# EasyEDA Pro project 交换机工具.epro, board PCB104
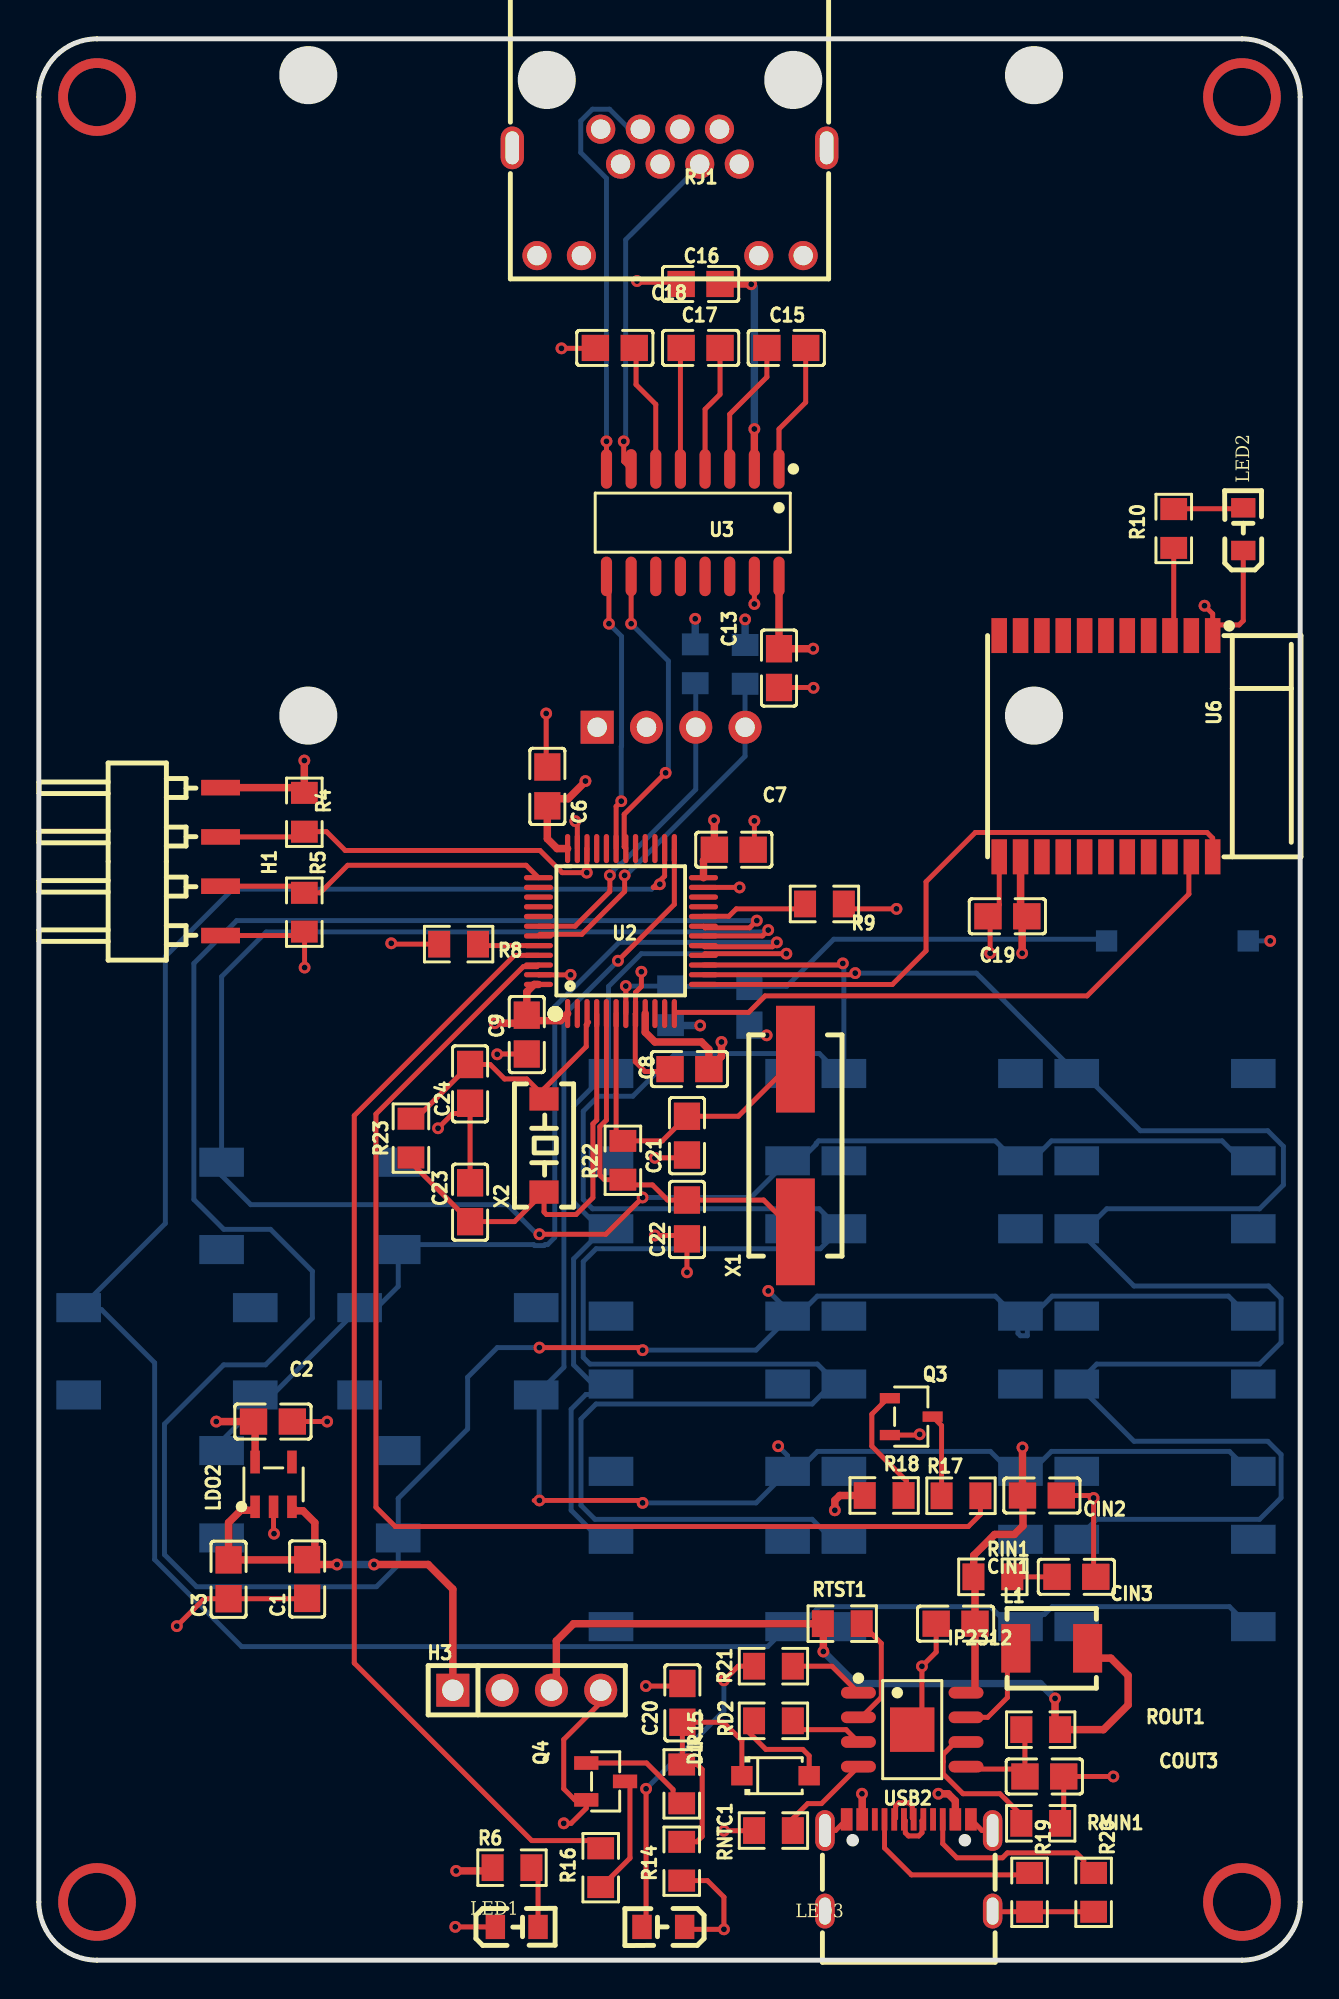
[diagram p4: board, top side]
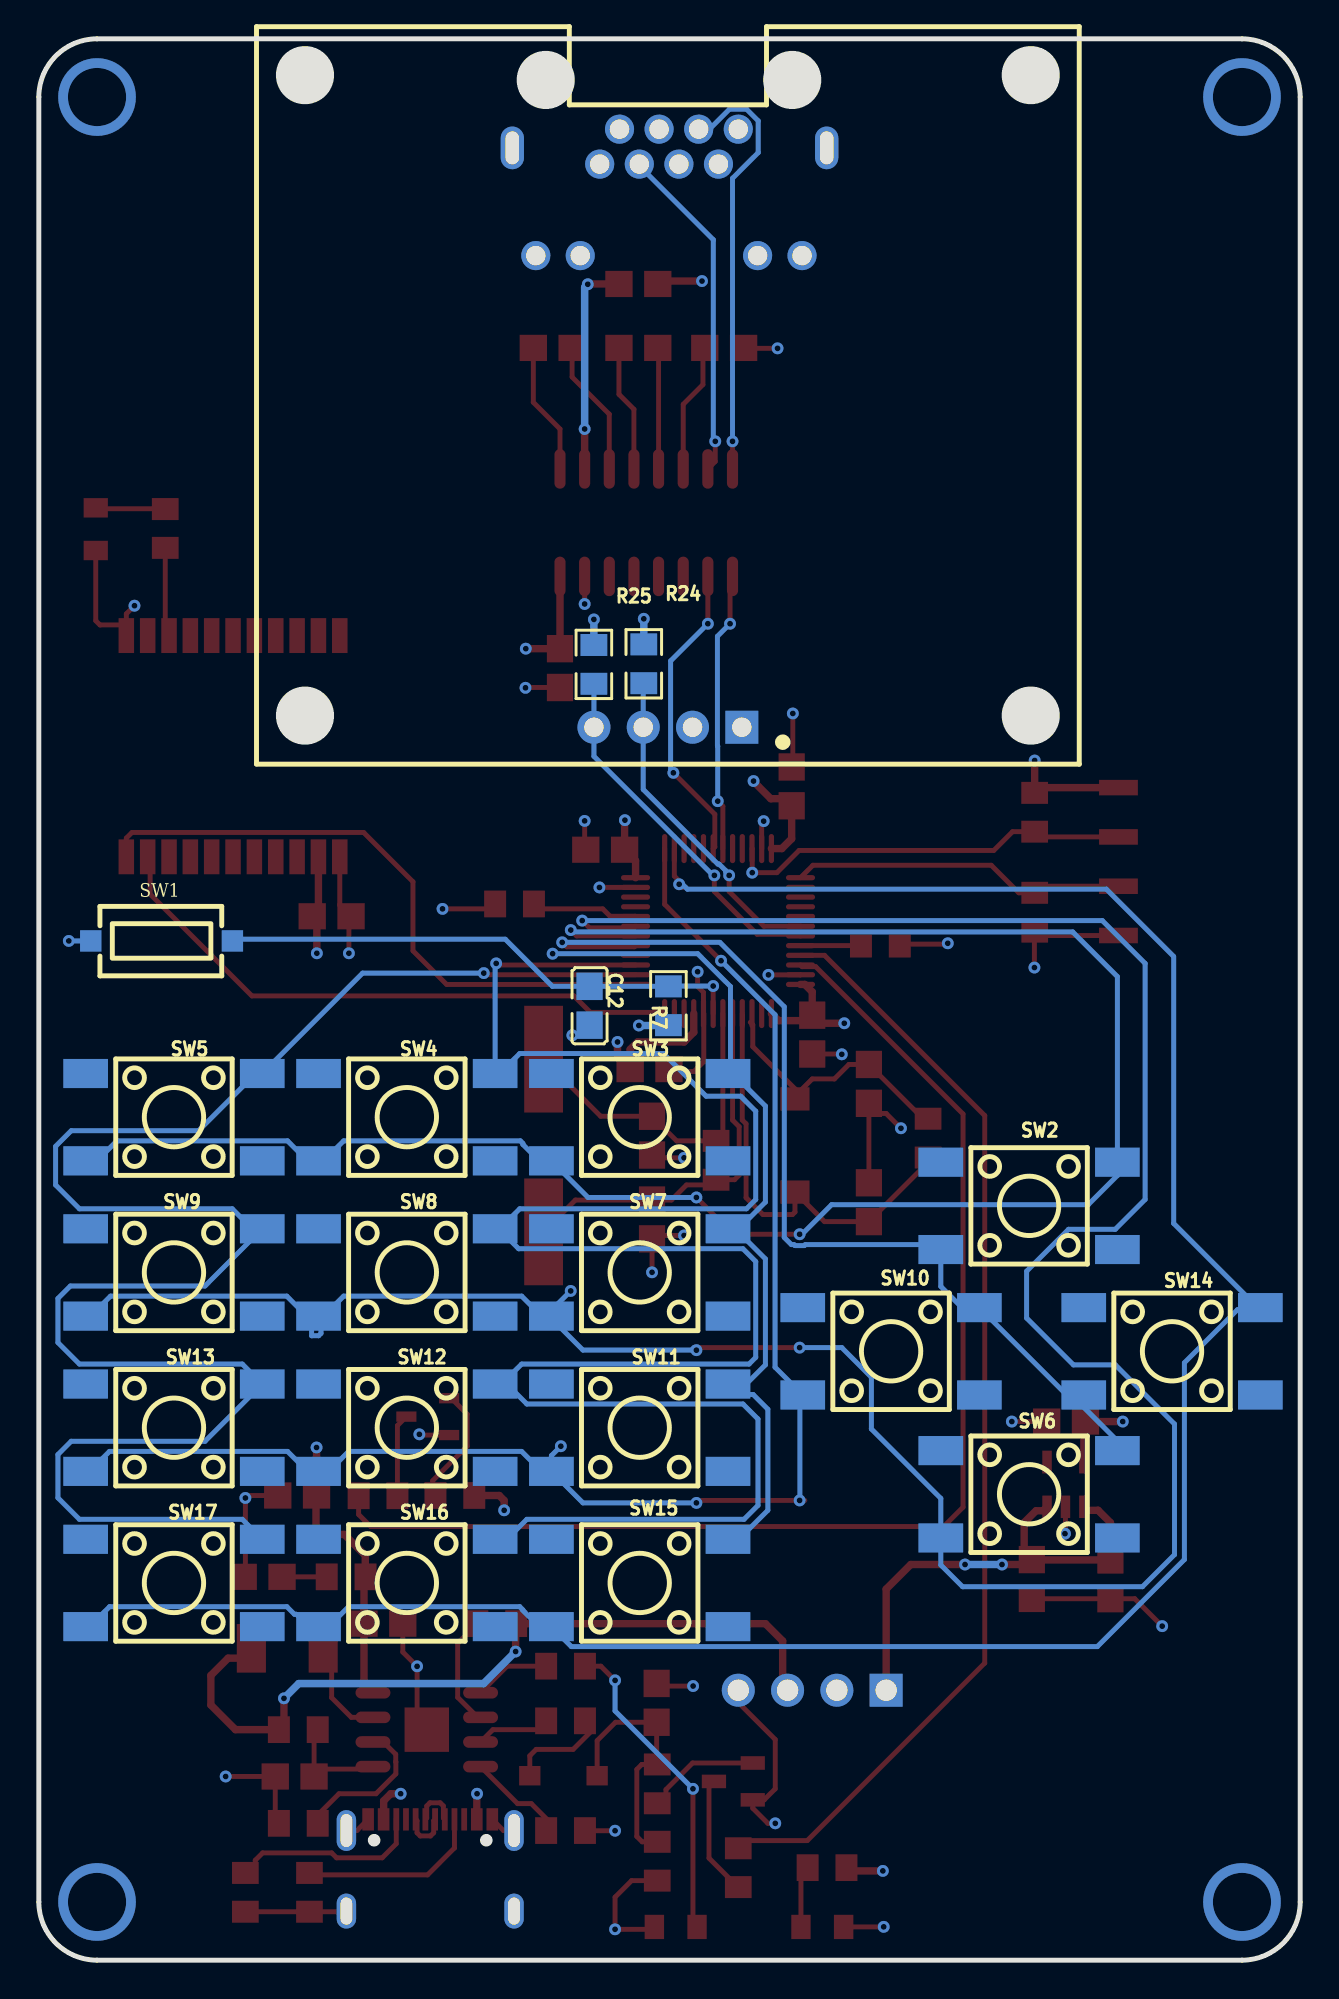
[diagram p5: board, bottom side, seen from below]

Outline 65 x 99 mm; copper layers: Top Layer, GND, PWR, Bottom Layer. Coordinates in mm from the lower left corner of the outline.
Outline path: 0,96 0,3 arc(0.88,0.88) 3,0 62,0 arc(64.12,0.88) 65,3 65,96 arc(64.12,98.12) 62,99 3,99 arc(0.88,98.12) 0,96
Stack: Top Layer 0.035mm 外层铜厚1oz / Dielectric1 0.2104mm 7628 RC49% 8.6mil / GND 0.0152mm 内层铜厚 / Dielectric2 1.065mm 1.1mm H/HOZ Copper / PWR 0.0152mm 内层铜厚 / Dielectric3 0.2104mm 7628 RC49% 8.6mil / Bottom Layer 0.035mm 外层铜厚1oz

## Design rules (mm)
template: 自定义配置
spacing copperThickness1oz (default): track to track 0.102, other pairs 0.152 to 0.3
spacing copperThickness2oz: track to track 0.203, other pairs 0.152 to 0.3
track width copperThickness1oz (default): min 0.127, default 0.254, max 2.54
track width copperThickness2oz: min 0.381, default 0.381, max 2.54
differential pair differentialPair (default): width min 0.127, default 0.254, max 2.54; gap min 0.152, default 0.152
via viaSize (default): diameter min 0.5, default 0.61, max 10; hole min 0.3, default 0.305, max 6.299
net 3V3 uses copperThickness2oz
net VBUS uses copperThickness2oz
net BAT+ uses copperThickness2oz

## Placement (name value [footprint] x y rotation side)
C1  10uF  [C0805]  13.83 19.64 90 top
C2  1uF  [C0805]  12.07 27.75 180 top
C3  100nF  [C0805]  9.78 19.62 90 top
C6  100nF  [C0805]  26.21 60.48 270 top
C7  100nF  [C0805]  35.81 57.22 180 top
C8  100nF  [C0805]  33.53 45.91 0 top
C9  100nF  [C0805]  25.15 47.69 90 top
C12  100nF  [C0805]  36.62 49.18 90 bottom
C13  0.1uF  [C0805]  38.14 66.58 270 top
C15  0.1uF  [C0805]  38.52 83.07 0 top
C16  0.1uF  [C0805]  34.1 86.37 0 top
C17  0.1uF  [C0805]  34.1 83.07 0 top
C18  0.1uF  [C0805]  29.68 83.07 0 top
C19  100nF  [C0805]  49.91 53.79 0 top
C20  1u  [C0805]  33.16 13.26 270 top
C21  20pF  [C0805]  33.4 42.48 90 top
C22  20pF  [C0805]  33.4 38.17 90 top
C23  10pf  [C0805]  22.23 39.06 270 top
C24  10pf  [C0805]  22.23 45.15 90 top
CIN1  22uF  [C0805]  47.24 17.34 0 top
CIN2  10uF  [C0805]  51.69 23.94 180 top
CIN3  10uF  [C0805]  53.47 19.75 180 top
COUT3  22uF  [C0805]  51.82 9.47 0 top
D1  1N4148W  [SOD-123F_L2.7-W1.6-LS3.8-RD]  37.96 9.51 0 top
H1  MH254RS-11-04-1000  [HDR-SMD_MH254RS-11-04-1000]  9.37 56.61 90 top
H3  PZ254V-11-04P  [HDR-TH_4P-P2.54-V-M]  25.15 13.91 0 top
IP2312  IP2312U_VSET  [SOP-8_L4.9-W3.9-P1.27-LS6.0-BL-EP]  45.01 11.88 270 top
L1  1uH  [IND-SMD_L4.6-W4.1_MHCI04015]  52.2 16.07 0 top
LDO2  ME6211C33M5G-N  [SOT-23-5_L3.0-W1.7-P0.95-LS2.8-BL]  12.1 24.51 0 top
LED1  -  [LED_0805]  24.68 1.71 0 top
LED2  XL-2012UBC  [LED_0805]  62.07 73.79 90 top
LED3  XL-2012UYC  [LED_0805]  32.13 1.72 180 top
OLED1  HS154L03W2C01  [OLED-TH_-4P-L42.4-W38.0-P2.54]  32.58 63.53 0 bottom
Q3  S8050  [SOT-23-3_L3.0-W1.7-P0.95-LS2.9-BR]  44.96 28.01 180 top
Q4  S8050-J3Y  [SOT-23-3_L2.9-W1.3-P0.95-LS2.4-BR-1]  29.21 9.21 180 top
R4  10K  [R0805]  13.68 59.15 90 top
R5  10K  [R0805]  13.68 54 270 top
R6  10K  [R0805]  24.38 4.77 0 top
R7  10K  [R0805]  32.56 49.18 270 bottom
R8  10K  [R0805]  21.63 52.35 180 top
R9  10K  [R0805]  40.48 54.42 180 top
R10  5.1kΩ  [R0805]  58.48 73.77 270 top
R14  4.7k  [R0805]  33.13 5.1 90 top
R15  10k  [R0805]  33.13 9.08 270 top
R16  1k  [R0805]  28.96 4.77 270 top
R17  1k  [R0805]  47.52 23.93 0 top
R18  10k  [R0805]  43.56 23.94 180 top
R19  5.1k  [R0805]  51.05 3.5 270 top
R20  5.1k  [R0805]  54.36 3.5 270 top
R21  100  [R0805]  37.86 15.15 180 top
R22  1M  [R0805]  30.1 41.22 270 top
R23  1M  [R0805]  19.18 42.36 90 top
R24  4.7k  [R0805]  33.83 66.8 90 bottom
R25  4.7k  [R0805]  36.4 66.77 270 bottom
RD2  1K  [R0805]  37.86 12.33 0 top
RIN1  2  [R0805]  49.16 19.75 180 top
RJ1  HC-WK88-H16-DB  [RJ45-TH_HC-WK88-H16-DB]  32.5 91.09 180 top
RMIN1  135K  [R0805]  51.63 7.05 180 top
RNTC1  51K  [R0805]  37.86 6.68 0 top
ROUT1  0.5  [R0805]  51.63 11.88 180 top
RTST1  1K  [R0805]  41.4 17.34 0 top
SW1  TS-1101-C-W  [SW-SMD_HX-TS-1101-C-W]  58.67 52.52 0 bottom
SW2  KH-6X6X5H-STM  [SW-SMD_4P-L6.0-W6.0-P4.50-LS9.0_H5.0]  13.97 38.87 180 bottom
SW3  KH-6X6X5H-STM  [SW-SMD_4P-L6.0-W6.0-P4.50-LS9.0_H5.0]  34.04 43.44 0 bottom
SW4  KH-6X6X5H-STM  [SW-SMD_4P-L6.0-W6.0-P4.50-LS9.0_H5.0]  46.04 43.44 0 bottom
SW5  KH-6X6X5H-STM  [SW-SMD_4P-L6.0-W6.0-P4.50-LS9.0_H5.0]  58.04 43.44 0 bottom
SW6  KH-6X6X5H-STM  [SW-SMD_4P-L6.0-W6.0-P4.50-LS9.0_H5.0]  13.97 24.01 0 bottom
SW7  KH-6X6X5H-STM  [SW-SMD_4P-L6.0-W6.0-P4.50-LS9.0_H5.0]  34.04 35.44 0 bottom
SW8  KH-6X6X5H-STM  [SW-SMD_4P-L6.0-W6.0-P4.50-LS9.0_H5.0]  46.04 35.44 0 bottom
SW9  KH-6X6X5H-STM  [SW-SMD_4P-L6.0-W6.0-P4.50-LS9.0_H5.0]  58.04 35.44 0 bottom
SW10  KH-6X6X5H-STM  [SW-SMD_4P-L6.0-W6.0-P4.50-LS9.0_H5.0]  21.08 31.37 0 bottom
SW11  KH-6X6X5H-STM  [SW-SMD_4P-L6.0-W6.0-P4.50-LS9.0_H5.0]  34.04 27.44 0 bottom
SW12  KH-6X6X5H-STM  [SW-SMD_4P-L6.0-W6.0-P4.50-LS9.0_H5.0]  46.04 27.44 0 bottom
SW13  KH-6X6X5H-STM  [SW-SMD_4P-L6.0-W6.0-P4.50-LS9.0_H5.0]  58.04 27.44 0 bottom
SW14  KH-6X6X5H-STM  [SW-SMD_4P-L6.0-W6.0-P4.50-LS9.0_H5.0]  6.6 31.37 180 bottom
SW15  KH-6X6X5H-STM  [SW-SMD_4P-L6.0-W6.0-P4.50-LS9.0_H5.0]  34.04 19.44 0 bottom
SW16  KH-6X6X5H-STM  [SW-SMD_4P-L6.0-W6.0-P4.50-LS9.0_H5.0]  46.04 19.44 0 bottom
SW17  KH-6X6X5H-STM  [SW-SMD_4P-L6.0-W6.0-P4.50-LS9.0_H5.0]  58.04 19.44 0 bottom
U2  STM32F103C8T6  [LQFP-48_L7.0-W7.0-P0.50-LS9.0-BL]  30 53.03 0 top
U3  MAX3232ESE(UMW)  [SOP-16_L9.9-W3.9-P1.27-LS6.0-BL]  33.7 74.07 180 top
U6  DX-BT04-E  [BULETM-SMD_DX-BT04-E]  54.99 62.55 270 top
USB2  TYPE-C16PIN  [USB-C-SMD_TYPE-C16PIN]  44.83 4.89 0 top
X1  8MHz  [CRYSTAL-SMD_L11.5-W4.8-LS12.7]  38.99 41.98 90 top
X2  32.768kHz  [CRYSTAL-SMD_L6.0-W3.0_SCPYS32X76800YERN]  26.04 41.98 90 top

## Footprints (pads in the part's own frame, mm; a bottom-side part is the same pattern mirrored in y, then rotated)
BULETM-SMD_DX-BT04-E
  rect 1.8x0.8 smd: 1(-5.7,5.5) 2(-5.7,4.4) 3(-5.7,3.3) 4(-5.7,2.2) 5(-5.7,1.1) 6(-5.7,0) 7(-5.7,-1.1) 8(-5.7,-2.2) 9(-5.7,-3.3) 10(-5.7,-4.4) 11(-5.7,-5.5) 12(5.7,-5.5) 13(5.7,-4.4) 14(5.7,-3.3) 15(5.7,-2.2) 16(5.7,-1.1) 17(5.7,0) 18(5.7,1.1) 19(5.7,2.2) 20(5.7,3.3) 21(5.7,4.4) 22(5.7,5.5)
C0805
  rect 1.41x1.35 smd: 1(-1,0) 2(1,0)
CRYSTAL-SMD_L6.0-W3.0_SCPYS32X76800YERN
  rect 1.2x1.5 smd: 1(-2.4,0) 2(2.4,0)
CRYSTAL-SMD_L11.5-W4.8-LS12.7
  rect 5.5x2 smd: 1(-4.45,0) 2(4.45,0)
HDR-SMD_MH254RS-11-04-1000
  rect 0.8x2 smd: 1(-3.81,0) 2(-1.27,0) 3(1.27,0) 4(3.81,0)
HDR-TH_4P-P2.54-V-M
  rect 1.7x1.7 hole 1.1: 1(-3.81,0)
  round 1.7 hole 1.1: 2(-1.27,0) 3(1.27,0) 4(3.81,0)
IND-SMD_L4.6-W4.1_MHCI04015
  rect 1.5x2.5 smd: 1(-1.85,0) 2(1.85,0)
LED_0805
  rect 1x1.25 smd: 1(-1.15,0.005) 2(1.05,0.005)
LQFP-48_L7.0-W7.0-P0.50-LS9.0-BL
  oval 0.27x1.5 smd: 1(-2.75,-4.25) 2(-2.25,-4.25) 3(-1.75,-4.25) 4(-1.25,-4.25) 5(-0.75,-4.25) 6(-0.25,-4.25) 7(0.25,-4.25) 8(0.75,-4.25) 9(1.25,-4.25) 10(1.75,-4.25) 11(2.25,-4.25) 12(2.75,-4.25) 25(2.75,4.25) 26(2.25,4.25) 27(1.75,4.25) 28(1.25,4.25) 29(0.75,4.25) 30(0.25,4.25) 31(-0.25,4.25) 32(-0.75,4.25) 33(-1.25,4.25) 34(-1.75,4.25) 35(-2.25,4.25) 36(-2.75,4.25)
  oval 1.5x0.27 smd: 13(4.25,-2.75) 14(4.25,-2.25) 15(4.25,-1.75) 16(4.25,-1.25) 17(4.25,-0.75) 18(4.25,-0.25) 19(4.25,0.25) 20(4.25,0.75) 21(4.25,1.25) 22(4.25,1.75) 23(4.25,2.25) 24(4.25,2.75) 37(-4.25,2.75) 38(-4.25,2.25) 39(-4.25,1.75) 40(-4.25,1.25) 41(-4.25,0.75) 42(-4.25,0.25) 43(-4.25,-0.25) 44(-4.25,-0.75) 45(-4.25,-1.25) 46(-4.25,-1.75) 47(-4.25,-2.25) 48(-4.25,-2.75)
OLED-TH_-4P-L42.4-W38.0-P2.54
  rect 1.7x1.7 hole 1: 1(-3.81,0)
  round 1.7 hole 1: 2(-1.27,0) 3(1.27,0) 4(3.81,0)
R0805
  rect 1.133x1.377 smd: 1(-1,0) 2(1,0)
RJ45-TH_HC-WK88-H16-DB
  round 1.5 hole 1: 1(3.543,-3.257) 2(2.523,-1.457) 3(1.504,-3.257) 4(0.483,-1.457) 5(-0.537,-3.257) 6(-1.557,-1.457) 7(-2.576,-3.257) 8(-3.597,-1.457) 11(-6.89,3.257) 12(-4.6,3.257) 13(4.54,3.257) 14(6.83,3.257)
  oval 1.2x2.2 hole 0.7x1.7: 9(8.1,-2.293) 10(-8.1,-2.293)
SOD-123F_L2.7-W1.6-LS3.8-RD
  rect 1.1x1 smd: 1(-1.735,0) 2(1.735,0)
SOP-8_L4.9-W3.9-P1.27-LS6.0-BL-EP
  oval 0.6x1.8 smd: 1(-1.905,-2.772) 2(-0.635,-2.772) 3(0.635,-2.772) 4(1.905,-2.772) 5(1.905,2.772) 6(0.635,2.772) 7(-0.635,2.772) 8(-1.905,2.772)
  rect 2.29x2.29 smd: 9(0,0)
SOP-16_L9.9-W3.9-P1.27-LS6.0-BL
  oval 0.574x2.038 smd: 1(-4.445,-2.769) 2(-3.175,-2.769) 3(-1.905,-2.769) 4(-0.635,-2.769) 5(0.635,-2.769) 6(1.905,-2.769) 7(3.175,-2.769) 8(4.445,-2.769) 9(4.445,2.769) 10(3.175,2.769) 11(1.905,2.769) 12(0.635,2.769) 13(-0.635,2.769) 14(-1.905,2.769) 15(-3.175,2.769) 16(-4.445,2.769)
SOT-23-3_L2.9-W1.3-P0.95-LS2.4-BR-1
  rect 1.25x0.7 smd: 1(1,-0.95) 2(1,0.95) 3(-1,0)
SOT-23-3_L3.0-W1.7-P0.95-LS2.9-BR
  rect 1.038x0.532 smd: 1(1.101,-0.95) 2(1.101,0.95) 3(-1.101,0)
SOT-23-5_L3.0-W1.7-P0.95-LS2.8-BL
  rect 0.49x1.157 smd: 1(-0.95,-1.153) 2(0,-1.153) 3(0.95,-1.153)
  rect 0.49x1.175 smd: 4(0.95,1.153) 5(-0.95,1.153)
SW-SMD_4P-L6.0-W6.0-P4.50-LS9.0_H5.0
  rect 2.3x1.5 smd: 1(-4.55,2.25) 2(4.55,2.25) 3(-4.55,-2.25) 4(4.55,-2.25)
SW-SMD_HX-TS-1101-C-W
  rect 1.1x1.1 smd: 1(-3.65,0) 2(3.65,0)
USB-C-SMD_TYPE-C16PIN
  oval 1x2.1 hole 0.6x1.7: 1(-4.32,1.788) 2(4.32,1.788)
  oval 1x1.8 hole 0.6x1.4: 3(-4.32,-2.362) 4(4.32,-2.362)
  rect 0.6x1.15 smd: A1B12(-3.2,2.362) A4B9(-2.4,2.362) B1A12(3.2,2.362) B4A9(2.4,2.362)
  rect 0.3x1.15 smd: A5(-1.25,2.362) A6(-0.25,2.362) A7(0.25,2.362) A8(1.25,2.362) B5(1.75,2.362) B6(0.75,2.362) B7(-0.75,2.362) B8(-1.75,2.362)

## Nets
As in the schematic.

Pads without a net: LDO2 4; RJ1 1 2 7 8 9 10 11 12 13 14; SW2 1 4; SW3 1 4; SW4 1 4; SW5 1 4; SW6 1 4; SW7 1 4; SW8 1 4; SW9 1 4; SW10 1 4; SW11 1 4; SW12 1 4; SW13 1 4; SW14 1 4; SW15 1 4; SW16 1 4; SW17 1 4; U2 2 10 11 21 22 27 28 29 32 33 38 39 40 41; U3 11 12 13 14; U6 2 4 5 6 7 8 9 10 11 14 15 16 17 18 19 20; USB2 A8 B8

## Via types
v1: diameter 4, hole 3, Top Layer to Bottom Layer, 4 vias
v2: diameter 0.61, hole 0.305, Top Layer to Bottom Layer, 84 vias

## Routing (per net, layer and track width the routed paths; a pad name or vN(x,y) marks a point on that pad's centre or on a via; arc(x,y) is an arc through that point)
3V3: length 50.7
  Top Layer w0.381: LDO2.5 11.15,27.67 C2.2 v2(9.14,27.75) ; U2.9 31.25,47.81 31.75,47.31 34.15,47.31 34.53,46.93 34.53,46.17 ; U6.13 50.59,54.11 C19.2 50.67,53.55 v2(50.67,51.88) ; v2(23.49,48.28) 24.73,48.28 C9.2 25.15,49.89 25.53,50.28 U2.48 ; v2(30.83,86.52) 32.95,86.52 C16.1 ; U2.36 26.71,57.28 26.21,57.78 C6.2 26.57,59.85 27.28,59.85 28.17,60.73 v2(28.17,60.76) ; v2(13.68,61.81) R4.2 13.41,60.42 H1.4 ; v2(21.51,4.6) 23.22,4.6 R6.1 ; U2.1 26.89,48.41 25.57,48.41 ; 39.92,67.59 v2(39.91,67.58) C13.1 U3.16 ; C8.2 35.18,46.56 v2(35.18,47.31) ; U2.24 34.25,56.65 C7.2 34.81,58.72 v2(34.8,58.74)
  Bottom Layer w0.381: R24.2 v2(33.83,69.12) ; v2(34.08,48.16) 32.67,48.16 32.56,48.05 ; 36.37,69.12 v2(36.4,69.08) R25.1
GND: length 117.5
  Top Layer w0.254: v2(31.05,50.93) 31.05,50.17 30.75,49.87 U2.8 30.73,48.76 30.73,46.3 31.24,45.79 32.15,45.79 32.4,46.04 C8.1 ; v2(27.4,50.77) 25.76,50.77 U2.47 ; v2(60.07,69.79) 60.49,69.37 60.49,68.95 ; v2(55.37,9.47) COUT3.2 52.82,7.24 RMIN1.1 ; v2(18.16,52.4) 18.2,52.35 R8.2 ; H1.1 13.48,52.8 R5.2 13.7,52.98 v2(13.7,51.15) ; C20.1 33.03,14.13 v2(31.29,14.13) ; USB2.4 49.19,2.5 R19.2 R20.2 ; USB2.A1B12 41.06,6.68 USB2.1 ; USB2.2 48.61,6.68 USB2.B1A12 ; C18.1 28.22,83.07 28.2,83.05 v2(26.93,83.05) ; v2(36.11,55.27) 36.11,55.28 U2.23 ; v2(27.05,7.05) 27.43,7.05 28.21,7.83 Q4.2 27.62,8.26 27.05,8.83 27.05,11.37 28.96,13.28 H3.4 ; v2(23.62,46.68) 23.64,46.69 C9.1 ; 62.07,72.64 62.07,69.02 61.85,68.8 60.64,68.8 60.49,68.95 ; v2(12.12,21.98) 12.1,22 LDO2.2 ; v2(35.31,6.67) 36.85,6.67 RNTC1.1 ; v2(31.75,41.34) 33.26,41.34 C21.1 ; v2(21.46,1.72) 21.47,1.71 LED1.1 ; v2(20.57,42.87) 21.34,43.63 22.23,43.63 ; 60.49,68.95 U6.1 ; LED3.1 33.4,1.59 v2(35.31,1.59) 35.31,3.25 34.45,4.1 R14.1 ; CIN3.1 54.36,19.86 v2(54.36,23.82) 54.23,23.94 CIN2.1 52.94,23.69 ; v2(49.02,51.88) 49.02,53.68 C19.1 49.49,54.37 U6.12 ; C1.1 13.81,18.62 C3.1 8.52,18.62 v2(7.11,17.21) ; v2(36.87,58.7) 36.87,57.28 C7.1 ; 22.23,43.63 C23.1 ; 22.23,43.63 C24.1 ; R9.1 41.74,54.17 v2(44.2,54.17) ; 31.88,37.34 33.23,37.34 C22.1 v2(33.4,35.44) ; CIN1.1 46.24,15.88 v2(45.51,15.14) 45.51,12.38 ; C6.1 26.15,61.54 v2(26.15,64.24) ; v2(45.39,27.1) 45.35,27.06 Q3.2 ; v2(39.92,65.56) 39.91,65.58 C13.2 ; v2(27.65,58.69) 27.75,58.59 U2.35 ; 36.87,71.3 v2(36.87,69.88) ; C2.1 v2(14.86,27.75)
  Bottom Layer w0.254: v2(37.51,47.65) 37.14,47.65 C12.1 ; SW1.2 v2(63.45,52.52) 63.54,52.61
  vias: v2(31.75,37.34)
VBUS: length 20.3
  Top Layer w0.381: v2(46.36,8.58) 46.86,8.58 47.23,8.21 USB2.B4A9 ; USB2.A4B9 42.43,8.56 v2(42.42,8.58) ; R18.2 41.27,23.94 41.02,23.69 v2(41.02,23.18) ; v2(50.69,26.42) CIN2.2 50.72,23.92 50.72,22.38 50.27,21.94 49.26,21.94 48.18,20.86 48.18,19.76 RIN1.2 48.24,19.67 CIN1.2 48.24,13.78 IP2312.8
(no net):
  vias: v1(3,96) v1(3,3) v1(62,96) v1(62,3)
BAT+: length 41.1
  Top Layer w0.381: v2(40.43,15.9) 40.43,17.31 RTST1.1 27.56,17.34 26.67,16.45 26.67,14.16 H3.3 ; L1.2 54.55,15.56 55.24,15.56 56.13,14.67 56.13,13.15 54.86,11.88 ROUT1.1 52.37,12.14 v2(52.37,13.49)
  Bottom Layer w0.381: v2(52.37,13.49) 51.61,14.25 42.08,14.25 v2(40.43,15.9)
C1: length 52.1
  Top Layer w0.254: U2.17 34.31,52.22 37.8,52.22 v2(38.03,52.44)
  Bottom Layer w0.254: SW6.3 9.42,26.76 11.15,28.49 SW14.3 12.03,29.12 SW10.3 17.43,33.62 18.52,34.72 SW2.3 18.77,36.87 25.5,36.87 25.55,36.82 26.04,36.82 26.09,36.87 26.22,36.87 26.59,37.24 26.59,49.13 29.9,52.44 v2(38.03,52.44)
C2: length 49.2
  Top Layer w0.254: v2(38.52,51.86) 34.33,51.86 U2.16
  Bottom Layer w0.254: SW15.3 29.39,21.59 29.03,21.59 27.43,23.18 27.43,28.39 28.19,29.15 28.9,29.15 29.24,29.49 29.24,29.69 ; 29.24,29.69 SW11.3 ; 29.24,29.69 28.55,29.69 27.56,30.67 27.56,36.14 29.11,37.69 ; 29.11,37.69 SW7.3 ; 29.11,37.69 28.93,37.69 27.56,39.06 27.56,44.01 29.24,45.69 SW3.3 29.36,45.81 29.36,50.17 31.05,51.86 v2(38.52,51.86)
C3: length 113.8
  Top Layer w0.254: v2(41.43,51.36) 41.35,51.28 U2.15
  Bottom Layer w0.254: SW8.3 41.49,37.31 41.35,37.17 ; 41.35,37.17 40.78,37.17 40.27,36.66 28.72,36.66 28.06,36 28.06,31.06 28.4,30.72 40.12,30.72 41.15,29.69 ; 41.35,37.17 41.35,37.59 40.22,38.72 28.53,38.72 28.06,39.19 28.06,43.75 28.83,44.52 30.61,44.52 32.81,46.72 40.22,46.72 40.99,45.95 40.99,45.53 41.12,45.39 41.16,45.39 41.37,45.19 41.58,45.4 SW4.3 41.49,51.31 v2(41.43,51.36) ; 41.15,29.69 40.88,29.69 39.85,28.66 28.71,28.66 27.94,27.88 27.94,23.44 28.66,22.72 39.85,22.72 40.5,22.07 41.11,22.07 SW16.3 ; 41.15,29.69 SW12.3
C4: length 98.6
  Top Layer w0.254: v2(42.07,50.86) 41.99,50.78 U2.14
  Bottom Layer w0.254: v2(42.07,50.86) 48.31,50.86 SW5.3 53.82,45.69 56.77,42.74 63.33,42.74 64.14,41.93 64.14,39.95 62.91,38.72 55.03,38.72 54,37.69 SW9.3 56.43,34.74 63.37,34.74 64.02,34.1 64.02,31.82 62.91,30.72 54.52,30.72 SW13.3 56.44,26.74 63.33,26.74 64.02,26.05 64.02,23.82 62.91,22.72 54.52,22.72 SW17.3
CC1: length 9.6
  Top Layer w0.254: USB2.A5 43.58,5.78 44.97,4.4 50.95,4.4 R19.1
CC2: length 9.9
  Top Layer w0.254: R20.1 53.85,5 53.85,5.15 53.47,5.53 49.91,5.53 49.66,5.27 47.31,5.27 46.58,6 USB2.B5
D+: length 2.4
  Top Layer w0.254: USB2.B6 45.51,7.18 45.51,6.56 45.35,6.4 44.82,6.4 44.65,6.56 44.65,7.18 USB2.A6
D-: length 2.4
  Top Layer w0.254: USB2.B7 44.15,7.33 44.15,7.95 44.32,8.11 44.85,8.11 45.01,7.95 45.01,7.33 USB2.A7
EC: length 64.5
  Top Layer w0.254: 48.52,23.85 48.52,22.97 47.9,22.34 18.37,22.34 17.37,23.34 17.37,43.6 24.96,51.19 25.66,51.19 U2.46
ET: length 57.8
  Top Layer w0.254: U2.45 24.51,51.78 16.26,43.52 16.26,15.31 25.4,6.16 28.56,6.16 R16.1
NRST: length 27.4
  Top Layer w0.254: U2.7 v2(30.25,50.19)
  Bottom Layer w0.254: v2(30.25,50.19) 32.32,50.19 32.54,49.97 32.54,49.91 ; R7.1 C12.2 38.54,50.18 40.96,52.61 54.93,52.61 SW1.1
OSC32_IN: length 13.6
  Top Layer w0.254: 28.34,48.33 28.21,48.2 28.21,47.07 26.04,44.9 26.04,44.52 ; X2.2 26.04,44.52 ; 26.04,44.52 25.15,45.41 24,45.41 23.26,46.15 C24.2 19.43,43.36 R23.2
OSC32_OUT: length 22.5
  Top Layer w0.254: R23.1 19.18,41.1 C23.2 24.51,38.06 X2.1 26.04,38.55 26.16,38.42 27.69,38.42 28.55,39.29 28.55,43.09 28.75,43.29 U2.4
OSC_IN: length 19.8
  Top Layer w0.254: U2.5 29.25,43.29 28.91,42.95 28.91,40.45 29.15,40.22 R22.2 30.37,39.95 31.62,39.95 32.4,39.17 C22.2 37.35,39.17 X1.1
OSC_OUT: length 17.3
  Top Layer w0.254: U2.6 29.75,42.56 R22.1 32.13,42.22 C21.2 36.05,43.48 X1.2
PA13: length 21.2
  Top Layer w0.254: H1.3 13.16,57.88 13.68,58.4 ; U2.34 28.24,57.26 v2(28.24,56.04) 26.97,56.04 25.82,57.18 15.79,57.18 14.82,58.15 R4.1
PA14: length 17.2
  Top Layer w0.254: R5.1 14.5,55 15.92,56.42 25.11,56.42 U2.37 ; 13.68,55.32 13.66,55.34 H1.2
R1: length 100.3
  Top Layer w0.254: U2.18 37.29,52.78 v2(37.59,53.08) ; v2(25.8,37.41) 29.22,37.41 v2(31.11,39.3)
  Bottom Layer w0.254: v2(37.59,53.08) 37.49,52.98 11.72,52.98 9.42,50.68 SW2.2 9.42,40.43 10.92,38.93 24.14,38.93 25.67,37.41 v2(25.8,37.41) ; 31.37,39.3 36.7,39.3 SW3.2 39.21,41.19 40.06,42.03 40.06,42.09 40.18,42.22 49.29,42.22 50.32,41.19 SW4.2 51.15,41.19 52.18,42.22 60.98,42.22 62,41.19 SW5.2
R2: length 143.4
  Top Layer w0.254: 25.67,31.56 30.98,31.56 v2(31.11,31.43) ; v2(37,53.57) 36.62,53.19 34.34,53.19 U2.19
  Bottom Layer w0.254: SW7.2 39.09,33.19 40.12,34.22 49.29,34.22 50.32,33.19 SW8.2 50.46,33.06 50.46,32.3 50.58,32.17 50.94,32.17 50.94,32.94 52.22,34.22 61.3,34.22 62.36,33.16 62.56,33.16 SW9.2 ; SW7.2 38.59,33.49 v2(37.59,34.48) ; SW7.2 38.59,33.06 36.96,31.44 31.37,31.44 31.24,31.56 ; 25.67,31.56 23.62,31.56 22.1,30.04 22.1,27.37 18.52,23.79 18.52,20.36 17.4,19.24 8.13,19.24 6.48,20.9 6.48,27.63 9.52,30.67 11.68,30.67 14.1,33.09 14.1,35.5 11.94,37.66 9.53,37.66 7.99,39.2 7.99,51.36 10.2,53.57 v2(37,53.57)
  vias: v2(25.8,31.56)
R3: length 77.5
  Top Layer w0.254: U2.25 32.75,54.4 v2(29.85,51.5) ; 25.53,23.69 30.99,23.69 v2(31.11,23.56)
  Bottom Layer w0.254: v2(31.11,23.56) 36.96,23.56 SW11.2 ; SW11.2 39.09,25.19 40.12,26.22 49.04,26.22 50.06,25.19 SW12.2 ; SW11.2 38.59,26 v2(38.1,26.48) ; SW13.2 62.38,25.19 61.35,26.22 52.18,26.22 51.35,25.38 50.59,25.38 ; v2(25.8,23.69) 25.78,23.7 25.78,28.97 SW10.2 27.06,30.55 27.06,48.71 v2(29.85,51.5)
R4: length 125.7
  Top Layer w0.254: v2(32,55.44) 31.84,55.27 31.67,55.27 32.25,55.86 U2.26
  Bottom Layer w0.254: v2(32,55.44) 31.83,55.44 31.58,55.19 9.99,55.19 6.52,51.72 6.52,37.96 2.18,33.62 SW14.2 2.16,33.52 3.23,33.52 5.97,30.78 5.97,20.64 10.45,16.16 37.56,16.16 SW15.2 39.22,17.19 40.06,18.03 40.06,18.05 40.22,18.22 49.03,18.22 50.06,17.19 SW16.2 51.09,17.19 51.73,17.82 51.83,17.82 52.22,18.22 61.35,18.22 61.85,17.72 62.31,17.72 62.59,17.44 SW17.2
RJ45_RX: length 22.2
  Top Layer w0.254: 29.25,76.84 v2(29.25,78.26)
  Bottom Layer w0.254: v2(29.25,78.26) 29.25,91.81 27.93,93.14 27.93,94.77 28.53,95.37 29.41,95.37 30.44,94.34 RJ1.3
RJ45_TX: length 17.5
  Top Layer w0.254: v2(30.14,78.26) 30.14,77.22 U3.7
  Bottom Layer w0.254: RJ1.6 34.06,92.46 30.24,88.65 30.24,78.26 v2(30.14,78.26)
SCL: length 17
  Top Layer w0.254: U2.42 27.64,53.28 29.43,55.07 v2(29.43,55.9)
  Bottom Layer w0.254: R24.1 33.85,65.77 OLED1.3 33.85,60.32 30.01,56.48 29.95,56.48 29.6,56.14 29.6,56.07 v2(29.43,55.9)
SDA: length 18.7
  Top Layer w0.254: v2(30.19,55.9) 30.19,55.07 27.98,52.86 25.84,52.86 U2.43
  Bottom Layer w0.254: v2(30.19,55.9) 30.26,55.9 36.39,62.03 OLED1.4 36.39,65.76 R25.2
U1_RX: length 14.3
  Top Layer w0.254: U2.31 29.75,59.45 v2(30.02,59.72) ; 29.25,71.3 29.38,71.17 29.38,68.99
  Bottom Layer w0.254: v2(30.02,59.72) 30.02,62.55 30.03,62.56 30.03,68.21 v2(29.38,68.86)
U1_TX: length 15.7
  Top Layer w0.254: U2.30 30.16,57.36 30.16,59.04 v2(32.3,61.18) ; U3.10 30.52,68.99
  Bottom Layer w0.254: v2(30.52,68.86) 32.44,66.94 32.44,61.32 v2(32.3,61.18)
U2_RX: length 32.7
  Top Layer w0.254: U6.22 60.49,57.81 60.2,58.11 48.26,58.11 45.72,55.57 45.72,52.01 43.99,50.28 U2.13
U2_TX: length 31
  Top Layer w0.254: U2.12 32.81,48.83 36.58,48.83 37.43,49.69 54.02,49.69 59.26,54.93 59.26,56.85
VOUT: length 24.6
  Top Layer w0.381: v2(17.27,20.39) 20.07,20.39 21.34,19.12 H3.1 ; C1.2 14.08,20.39 v2(15.37,20.39) ; LDO2.1 10.97,23.18 10.41,23.18 9.78,22.55 C3.2 13.81,20.62 ; LDO2.3 13.25,23.16 13.61,23.16 14.22,22.55 14.22,21.04 13.84,20.66
  Bottom Layer w0.381: v2(17.27,20.39) v2(15.37,20.39)
$1N5805: length 3.2
  Top Layer w0.254: R6.2 25.73,4.42 LED1.2
$1N6642: length 3.1
  Top Layer w0.254: R8.1 22.71,52.28 U2.44
$1N6713: length 5.5
  Top Layer w0.254: R9.2 39.23,54.17 35.94,54.17 35.56,53.79 34.26,53.79 U2.20
$1N7190: length 6.8
  Top Layer w0.254: C15.2 39.52,80.27 38.14,78.9 U3.1
$1N7397: length 6.6
  Top Layer w0.254: C17.2 35.1,80.68 34.33,79.91 U3.4
$1N7404: length 6.7
  Top Layer w0.254: C18.2 30.78,82.98 30.78,81.18 31.79,80.17 U3.6
$1N7408: length 6.3
  Top Layer w0.254: C17.1 33.06,83.03 U3.5
$1N10752: length 4.6
  Top Layer w0.254: R10.2 58.48,68.45 U6.3
$1N10781: length 3.6
  Top Layer w0.254: 62.07,74.79 58.5,74.79 R10.1
$1N13418: length 5.7
  Top Layer w0.254: 50.82,9.59 50.82,11.69 ROUT1.2 ; 50.82,9.59 COUT3.1 ; 50.82,9.59 50.56,9.85 47.91,9.85 IP2312.5
$1N13419: length 5.3
  Top Layer w0.254: IP2312.7 48.89,12.51 49.91,13.53 49.91,15.63 L1.1
$1N13420: length 7.8
  Top Layer w0.254: RMIN1.2 50.63,7.48 49.53,8.58 47.62,8.58 46.6,9.6 46.6,10.21 46.61,10.22 46.61,10.61 47.24,11.24 IP2312.6
$1N13421: length 5.3
  Top Layer w0.254: 36.52,12.33 36.52,11.81 37.46,10.86 39.37,10.86 39.7,10.53 D1.2
$1N13422: length 4.3
  Top Layer w0.254: 38.52,15.15 40.87,15.15 IP2312.1
$1N13425: length 12.8
  Top Layer w0.254: 33.7,12.22 33.66,12.26 35.28,12.26 36.23,11.31 D1.1 ; R14.2 33.91,6.1 34.18,6.38 34.18,9.83 33.93,10.08 R15.1 33.16,10.12 C20.2
$1N13431: length 6.3
  Top Layer w0.254: R18.1 44.7,24.09 44.7,24.71 42.93,26.48 42.93,28.13 43.75,28.96 Q3.1
$1N13432: length 5.5
  Top Layer w0.254: Q4.1 31.31,10.16 32.68,8.79 32.68,8.28
$1N13433: length 6.2
  Top Layer w0.254: Q4.3 30.46,8.96 30.46,5.26 28.96,3.75
$1N13437: length 4.2
  Top Layer w0.254: IP2312.3 41.6,11.88 38.97,11.88 38.52,12.33
$1N13439: length 5.8
  Top Layer w0.254: IP2312.2 42.39,12.51 43.42,13.54 43.42,16.33 RTST1.2
$1N13444: length 2.3
  Top Layer w0.254: RIN1.1 CIN3.2
$1N13445: length 5.2
  Top Layer w0.254: 38.52,6.68 38.52,6.96 39.62,8.07 40.33,8.07 IP2312.4
$1N13446: length 4.3
  Top Layer w0.254: 46.52,23.85 46.52,27.54 Q3.3
$1N15528: length 16
  Top Layer w0.254: v2(31.29,8.83) 31.29,1.92 LED3.2 ; 36.52,15.15 36.04,15.15 v2(35.31,14.42)
  Bottom Layer w0.254: v2(31.29,8.83) 35.31,12.84 v2(35.31,14.42)
$1N31315: length 7
  Top Layer w0.254: C15.1 37.52,81.57 35.6,79.66 U3.3
$1N31322: length 11.2
  Top Layer w0.381: C16.2 36.7,86.37 v2(36.71,86.35) ; v2(36.87,78.9) 36.87,76.84
  Bottom Layer w0.381: v2(36.71,86.35) 36.87,86.19 v2(36.87,78.9)

## Copper pours and planes (outline as drawn; the poured copper is in the pictures)
3V3 on PWR: 0.26,89.62 52.96,89.62 52.96,0.26 0.26,0.26
GND on GND: 0.26,98.74 64.74,98.74 64.74,0.26 0.26,0.26
GND on PWR: 0.26,98.74 64.74,98.74 64.74,0.26 0.26,0.26
VBUS on PWR: 19.81,26.61 59,26.61 59,1.21 19.81,1.21

Small or netless copper shapes (teardrops, artwork), in the pictures only: 28 on GND, 13 on PWR
